# Altium schematic sheet Sheet1.SchDoc
size A4
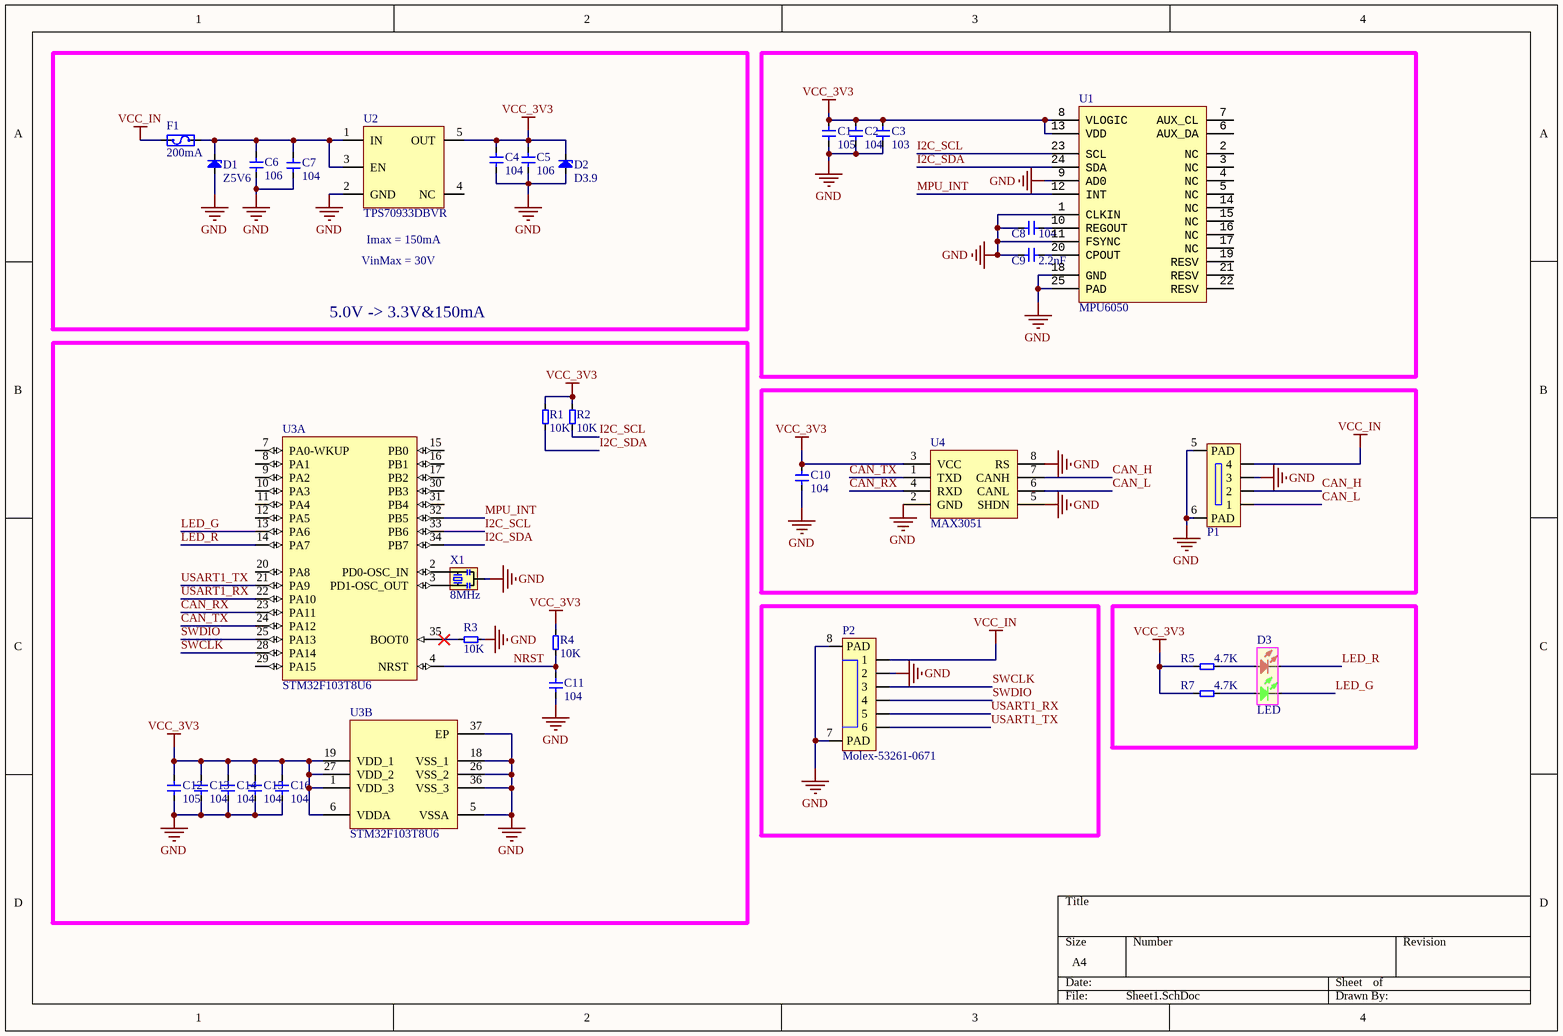
[diagram p0: Sheet1.SchDoc]

## Parts
C1  105  [CAP-0603-L]
C2  104  [CAP-0603-L]
C3  103  [CAP-0603-L]
C4  104  [CAP-0603-L]
C5  106  [CAP-0805-L]
C6  106  [CAP-0805-L]
C7  104  [CAP-0603-L]
C8  104  [CAP-0603-L]
C9  2.2nF  [CAP-0603-L]
C10  104  [CAP-0603-L]
C11  104  [CAP-0603-L]
C12  105  [CAP-0603-L]
C13  104  [CAP-0603-L]
C14  104  [CAP-0603-L]
C15  104  [CAP-0603-L]
C16  104  [CAP-0603-L]
D1  Z5V6  [SOD_323]
D2  D3.9  [SOD_323]
D3  LED  [LED_1616]
F1  200mA  [Fuse-0603]
P1  GH04  [SM04B-GHS-TB]  (value not drawn)
P2  Molex-53261-0671  [Molex-53261-0671]
R1  10K  [R-0603-L]
R2  10K  [R-0603-L]
R3  10K  [R-0603-L]
R4  10K  [R-0603-L]
R5  4.7K  [R-0603-L]
R7  4.7K  [R-0603-L]
U1  MPU6050  [QFN-24-4x4]
U2  TPS70933DBVR  [SOT-23-5]
U3  STM32F103T8U6  [STM-VFQFPN36_N]  (parts A,B of 2)
U4  MAX3051  [SOT-23-8]
X1  8MHz  [CSTCE_G(A)村田晶振]

## Blocks framed on the sheet
5.0V -> 3.3V&150mA: C4-C7 D1 D2 F1 U2

## Nets
GND: C1.1 C2.1 C3.1 C4.2 C5.1 C6.1 C7.1 C8.1 C9.1 C10.1 C11.1 C12.1 C13.1 C14.1 C15.1 C16.1 D1.1 D2.1 P1.3 P1.5(PAD) P1.6(PAD) P2.2 P2.7(PAD) P2.8(PAD) R3.2 U1.1(CLKIN) U1.9(AD0) U1.11(FSYNC) U1.18(GND) U1.25(PAD) U2.2(GND) U3.5(VSSA) U3.18(VSS_1) U3.26(VSS_2) U3.36(VSS_3) U3.37(EP) U4.2(GND) U4.5(SHDN) U4.8(RS) X1.2(GND)
VCC_3V3: C1.2 C2.2 C3.2 C4.1 C5.2 C10.2 C12.2 C13.2 C14.2 C15.2 C16.2 D2.2 R1.2 R2.2 R4.2 R5.1 R7.1 U1.8(VLOGIC) U1.13(VDD) U2.5(OUT) U3.1(VDD_3) U3.6(VDDA) U3.19(VDD_1) U3.27(VDD_2) U4.3(VCC)
VCC_IN: F1.1 P1.4 P2.1
CAN_H: P1.2 U4.7(CANH)
CAN_L: P1.1 U4.6(CANL)
CAN_RX: U3.23(PA11) U4.4(RXD)
CAN_TX: U3.24(PA12) U4.1(TXD)
I2C_SCL: R2.1 U1.23(SCL) U3.33(PB6)
I2C_SDA: R1.1 U1.24(SDA) U3.34(PB7)
LED_G: D3.2 U3.13(PA6)
LED_R: D3.1 U3.14(PA7)
MPU_INT: U1.12(INT) U3.32(PB5)
NRST: C11.2 R4.1 U3.4(NRST)
SWCLK: P2.3 U3.28(PA14)
SWDIO: P2.4 U3.25(PA13)
USART1_RX: P2.5 U3.22(PA10)
USART1_TX: P2.6 U3.21(PA9)
NetC6_2: C6.2 C7.2 D1.2 F1.2 U2.1(IN) U2.3(EN)
NetC8_2: C8.2 U1.10(REGOUT)
NetC9_2: C9.2 U1.20(CPOUT)
NetD3_3: D3.3 R7.2
NetD3_4: D3.4 R5.2
NetR3_1: R3.1 U3.35(BOOT0)
NetU3_2: U3.2(PD0-OSC_IN) X1.3(OSC2)
NetU3_3: U3.3(PD1-OSC_OUT) X1.1(OSC1)

Not connected (* = marked no-connect by the designer): U1 2(NC) 3(NC) 4(NC) 5(NC) 6(AUX_DA) 7(AUX_CL) 14(NC) 15(NC) 16(NC) 17(NC) 19(RESV) 21(RESV) 22(RESV); U2 4(NC); U3 7(PA0-WKUP) 8(PA1) 9(PA2) 10(PA3) 11(PA4) 12(PA5) 15(PB0) 16(PB1) 17(PB2) 20(PA8) 29(PA15) 30(PB3) 31(PB4)

## Notes on the sheet
- (near U2) Imax = 150mA
- VinMax = 30V

## Library data of the parts
C1-C16 = CAP
D1 D2 = Diode_ZD
D3 = LEDx2: 双色led
F1 = Fuse
P1 = GHS-M04B: 04GH座
P2 = Molex-53261-0671: 1.25mm Pitch PicoBlade Header
R1-R5 R7 = Res
U1 = MPU6050: Sensor Motion; Type: QFN24 P0.4
U2 = TPS709: 具有使能端的 150-mA 超低 Iq LDO
U3 = STM32F103T8U6: ARM Cortex-M3 32-bit MCU, 64 KB Flash, 20 KB Internal RAM, 26 I/Os, 36-pin VFQFPN, -40 to 85 degC, Tray; A/D Converter: 2x12-bit (10 Channel); FLASH Size (Prog) (kB): 64; I/Os (High Current): 26; Internal RAM Size (kB): 20; Operating Frequency(F) (Processor speed) (MHz): 72; Supply Voltage(Vcc) min (V): 2; DatasheetVersion: Rev. 16; PackageVersion: Rev. 16, 08/2013; PackageReference: VFQFPN36; PackageDescription: 36-Pin Quad Flat No-Lead, 6 x 6 x 1.0 mm Body, 0.5 mm Pitch, Exposed Pad; Supplier 1: Digi-Key; Supplier Part Number 1: 497-11532-ND; Supplier 2: Farnell; Supplier Part Number 2: 1606329; Supplier 3: Newark; Supplier Part Number 3: 11N8298; Supplier 4: Mouser; Supplier Part Number 4: 511-STM32F103T8U6; Core: ARM Cortex-M3; Packing: Tray; Mounting Technology: Surface Mount; PartNumber: STM32F103T8U6; ComponentLink1Description: Manufacturer URL; ComponentLink1URL: http://www.st.com/web/en/home.html; ComponentLink2Description: Datasheet; ComponentLink2URL: http://www.st.com/st-web-ui/static/active/en/resource/technical/document/datasheet/CD00161566.pdf; ComponentLink3Description: Package Specification; ComponentLink3URL: http://www.st.com/st-web-ui/static/active/en/resource/technical/document/datasheet/CD00161561.pdf
U4 = MAX3051: CAN控制器
X1 = XTAL-3215